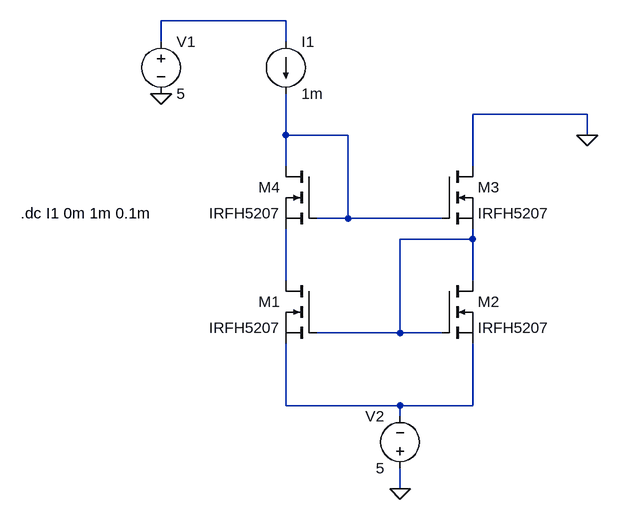
[diagram p0: schematic cascode_current_mirror.asc]
cascode_current_mirror.asc, the LTspice schematic file:
Version 4
SHEET 1 880 680
WIRE 112 -336 -80 -336
WIRE -80 -304 -80 -336
WIRE 112 -304 112 -336
WIRE 576 -192 400 -192
WIRE 112 -160 112 -224
WIRE 208 -160 112 -160
WIRE 576 -160 576 -192
WIRE 112 -112 112 -160
WIRE 400 -112 400 -192
WIRE 208 -32 208 -160
WIRE 208 -32 160 -32
WIRE 352 -32 208 -32
WIRE 400 0 400 -16
WIRE 400 0 288 0
WIRE 112 64 112 -16
WIRE 400 64 400 0
WIRE 288 144 288 0
WIRE 288 144 160 144
WIRE 352 144 288 144
WIRE 112 256 112 160
WIRE 288 256 112 256
WIRE 400 256 400 160
WIRE 400 256 288 256
WIRE 288 272 288 256
WIRE 288 384 288 352
FLAG -80 -224 0
FLAG 288 384 0
FLAG 576 -160 0
SYMBOL nmos 160 64 M0
SYMATTR InstName M1
SYMATTR Value IRFH5207
SYMBOL current 112 -304 R0
WINDOW 123 0 0 Left 0
WINDOW 39 0 0 Left 0
SYMATTR InstName I1
SYMATTR Value 1m
SYMBOL voltage -80 -320 R0
WINDOW 123 0 0 Left 0
WINDOW 39 0 0 Left 0
SYMATTR InstName V1
SYMATTR Value 5
SYMBOL voltage 288 368 R180
WINDOW 0 24 96 Left 2
WINDOW 3 24 16 Left 2
WINDOW 123 0 0 Left 0
WINDOW 39 0 0 Left 0
SYMATTR InstName V2
SYMATTR Value 5
SYMBOL nmos 352 64 R0
SYMATTR InstName M2
SYMATTR Value IRFH5207
SYMBOL nmos 352 -112 R0
SYMATTR InstName M3
SYMATTR Value IRFH5207
SYMBOL nmos 160 -112 M0
SYMATTR InstName M4
SYMATTR Value IRFH5207
TEXT -296 -40 Left 2 !.dc I1 0m 1m 0.1m

The netlist it stands for:
* cascode_current_mirror.asc
M1 N004 N003 N005 N005 IRFH5207
I1 N001 N002 1m
V1 N001 0 5
V2 0 N005 5
M2 N003 N003 N005 N005 IRFH5207
M3 0 N002 N003 N003 IRFH5207
M4 N002 N002 N004 N004 IRFH5207
.model NMOS NMOS
.model PMOS PMOS
.lib standard.mos
.dc I1 0m 1m 0.1m
.backanno
.end